# EAGLE design Quimera_IMU_board (EAGLE 7.5.0)
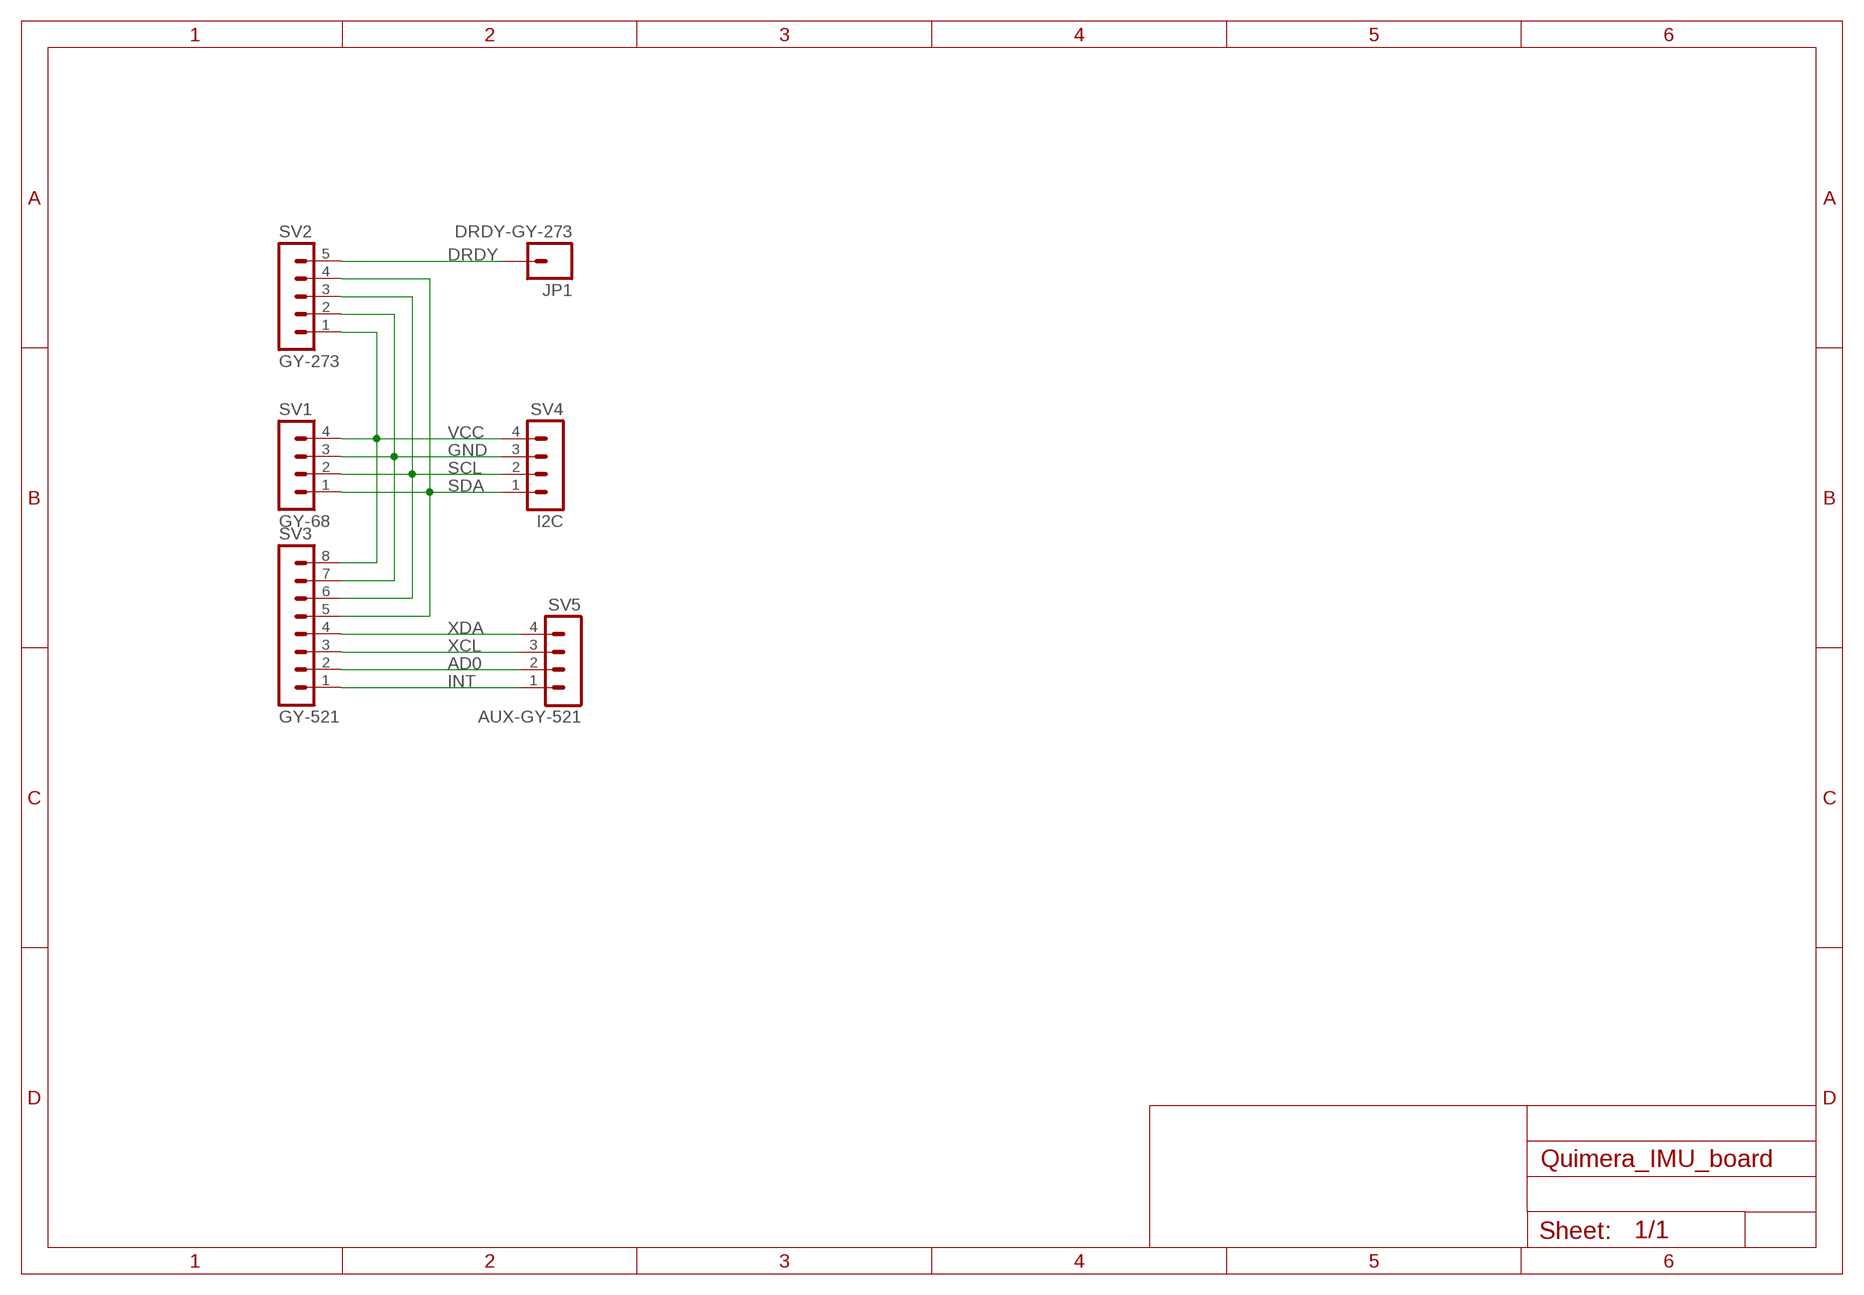
[diagram p0: schematic, sheet 1]

## Parts
JP1  DRDY-GY-273  M01OFFSET  [1X01_OFFSET]
SV1  GY-68  MA04-1  [MA04-1]
SV2  GY-273  MA05-1  [MA05-1]
SV3  GY-521  MA08-1  [MA08-1]
SV4  I2C  MA04-1  [MA04-1]
SV5  AUX-GY-521  MA04-1  [MA04-1]

## Nets
AD0: SV3.2 SV5.2
DRDY: JP1.1 SV2.5
GND: SV1.3 SV2.2 SV3.7 SV4.3
INT: SV3.1 SV5.1
SCL: SV1.2 SV2.3 SV3.6 SV4.2
SDA: SV1.1 SV2.4 SV3.5 SV4.1
VCC: SV1.4 SV2.1 SV3.8 SV4.4
XCL: SV3.3 SV5.3
XDA: SV3.4 SV5.4

## Library data of the parts
JP1 = SparkFun-Connectors:M01: Header 1 Standard 1-pin 0.1" header. Use with straight break away headers (SKU : PRT-00116), right angle break away headers (PRT-00553), swiss pins (PRT-00743), machine pins (PRT-00117), and female headers (PRT-00115). SMTSO-256-ET is a "flush mount" nut for a 4-40 screw. The older package used to be too tight, and did not allow it to sit properly thru the drill hit. The latest (0.165DIA) fits nice and snug.
SV1 SV4 SV5 = con-lstb:MA04-1: PIN HEADER; OC_FARNELL: unknown; OC_NEWARK: unknown
SV2 = con-lstb:MA05-1: PIN HEADER; OC_FARNELL: unknown; OC_NEWARK: unknown
SV3 = con-lstb:MA08-1: PIN HEADER; OC_FARNELL: unknown; OC_NEWARK: unknown

## Board
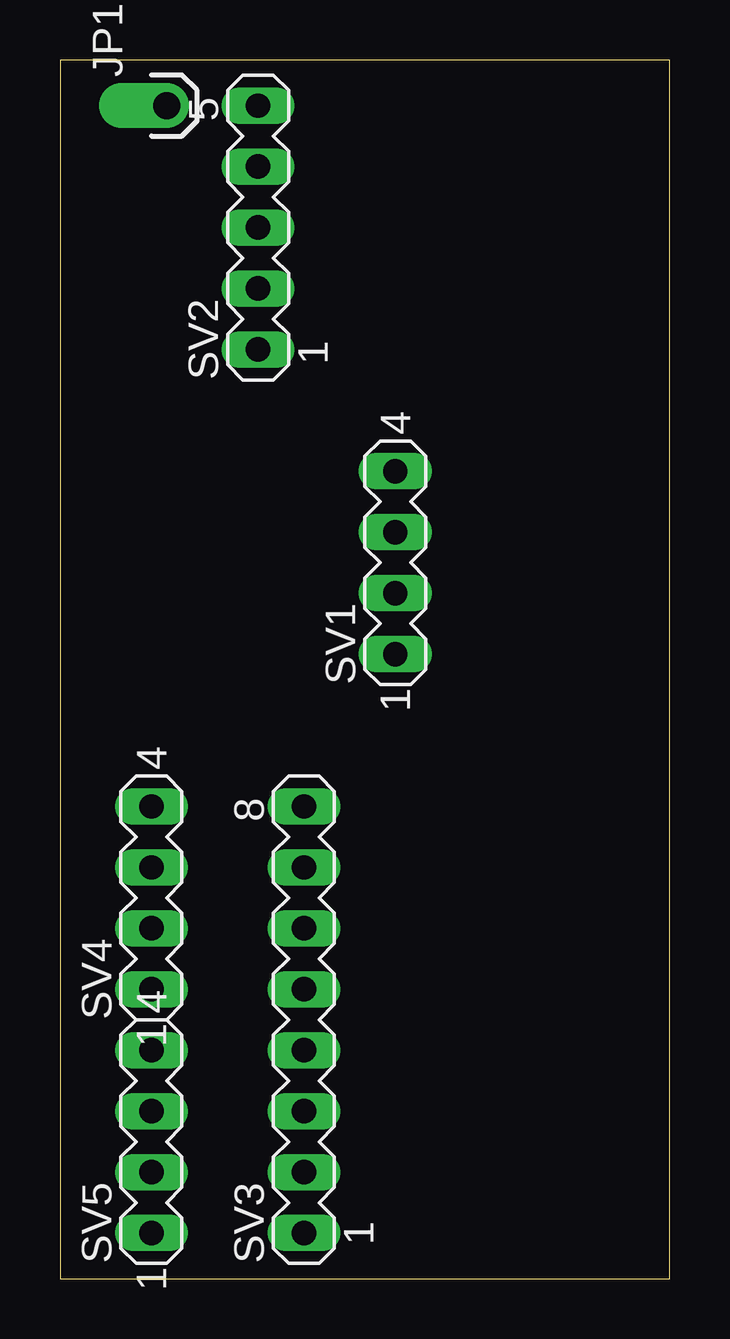
[diagram p1: board, top side]
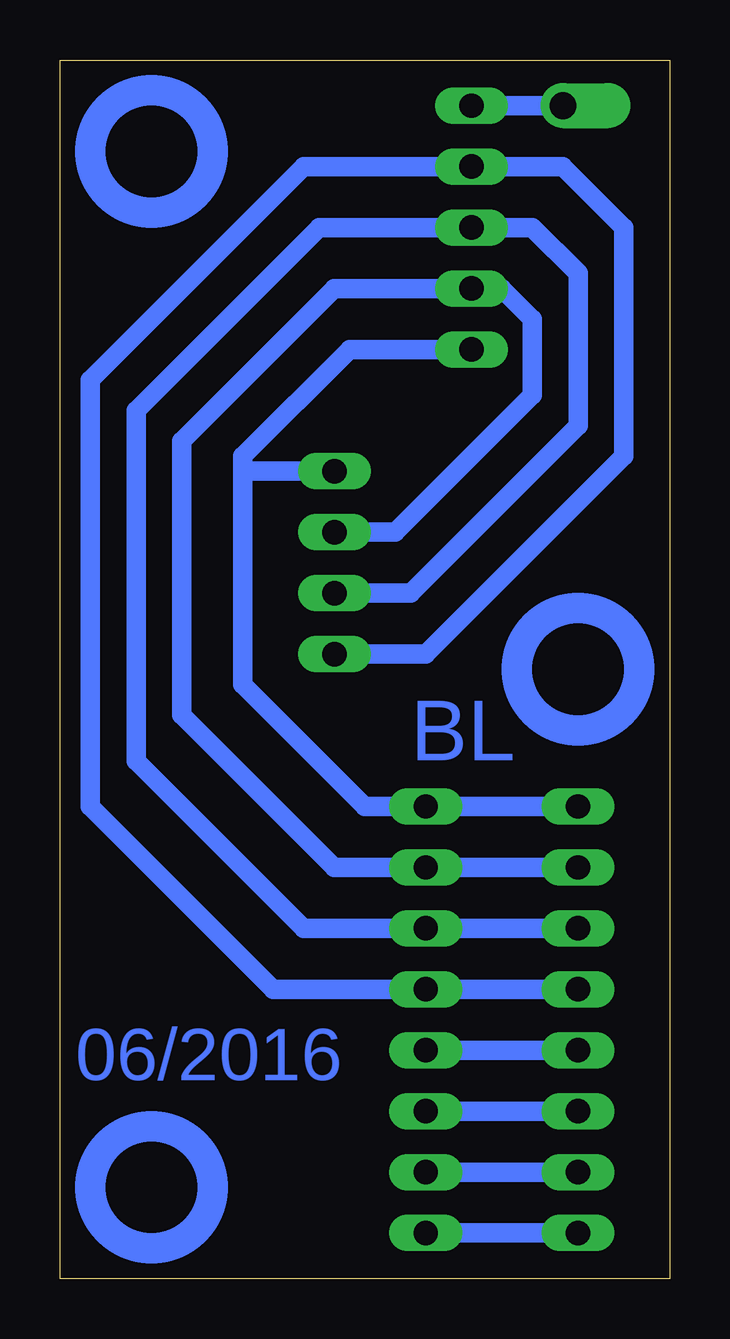
[diagram p2: board, bottom side, seen from below]

Size 25.4 x 50.8 mm. Coordinates in mm from the lower left corner, seen from the top.
Outline: 0,0 25.4,0 25.4,50.8 0,50.8 0,0
Copper layers (1*16): Top 0.035mm / dielectric 1.5mm / Bottom 0.035mm
Design rules "default": minimum track width 10mil, minimum drill 24mil, track to track 8mil, track to pad 8mil, pad to pad 8mil, via to via 8mil, smd to smd 8mil, copper to edge 40mil, drill to drill 8mil, minimum pad ring 10mil, minimum via ring 8mil, stop-mask expansion 4mil, vias tented up to drill 0mil, thermal gap 10mil

### Footprints (pad centres in the part's own frame; a part is rotated, then mirrored left to right if it is on the bottom)
1X01_OFFSET = drill 1.118 pad 1.88 offset: 1 0,0
MA04-1 = drill 1.016 long: 1 -3.81,0; 2 -1.27,0; 3 1.27,0; 4 3.81,0
MA05-1 = drill 1.016 long: 1 -5.08,0; 2 -2.54,0; 3 0,0; 4 2.54,0; 5 5.08,0
MA08-1 = drill 1.016 long: 1 -8.89,0; 2 -6.35,0; 3 -3.81,0; 4 -1.27,0; 5 1.27,0; 6 3.81,0; 7 6.35,0; 8 8.89,0

### Placement (x,y rotation side)
JP1  4.45,48.9 90 top
SV1  13.97,29.84 90 top
SV2  8.26,43.81 90 top
SV3  10.16,10.79 90 top
SV4  3.81,15.88 90 top
SV5  3.81,5.71 90 top

### Tracks (layer width: path | path; a pad name or v marks a point on that pad's centre or on a via)
AD0
  Bottom 0.813: SV5.2 SV3.2
DRDY
  Bottom 0.813: JP1.1 SV2.5
GND
  Bottom 0.813: SV4.3 SV3.7 13.97,17.14 20.32,23.5 20.32,34.92 13.97,41.27 SV2.2 6.99,41.27 5.71,40.01 5.71,36.83 11.43,31.11 SV1.3
INT
  Bottom 0.813: SV5.1 SV3.1
SCL
  Bottom 0.813: SV4.2 SV3.6 15.24,14.61 22.23,21.59 22.23,36.2 14.61,43.81 SV2.3 5.71,43.81 3.81,41.91 3.81,35.56 10.79,28.57 SV1.2
SDA
  Bottom 0.813: SV4.1 SV3.5 16.51,12.06 24.13,19.68 24.13,37.47 15.24,46.35 SV2.4 4.45,46.35 1.91,43.81 1.91,34.29 10.16,26.04 SV1.1
VCC
  Bottom 0.813: SV2.1 13.34,38.73 17.78,34.29 17.78,33.66 | 17.78,33.66 17.78,24.77 12.7,19.68 SV3.8 SV4.4 | 17.78,33.66 SV1.4
XCL
  Bottom 0.813: SV5.3 SV3.3
XDA
  Bottom 0.813: SV5.4 SV3.4
(copper drawn outside any net)
  shapes: Bottom circle x3

### Text on the board
Bottom: BL | 06/2016